# EAGLE schematic UVicorn-kit (EAGLE 7.6.0)
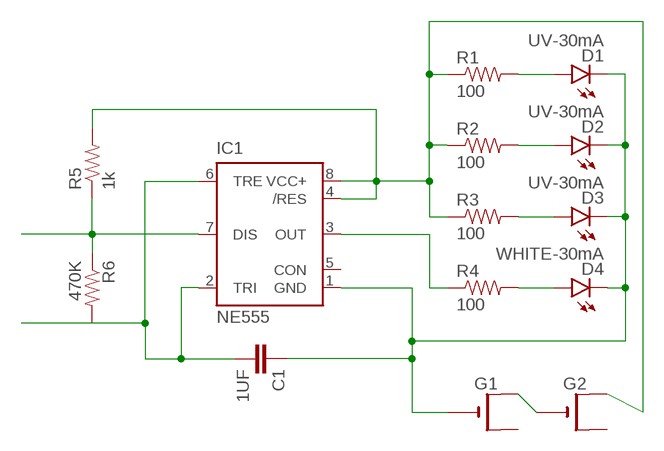
[diagram p0: schematic, sheet 1]

## Parts
C1  1UF  CAP_  [AXIAL-5MM]
D1  UV-30mA  LED  [LED5MM_ANYSIDES]
D2  UV-30mA  LED  [LED5MM_ANYSIDES]
D3  UV-30mA  LED  [LED5MM_ANYSIDES]
D4  WHITE-30mA  LED  [LED5MM_ANYSIDES]
G1  CR2032  [CR2032-EDIT]
G2  CR2032  [CR2032-EDIT]
IC1  NE555  [DIL-08]
R1  100  1KOHM-1/4W-5%(PTH)HORIZ-KIT  [AXIAL-0.3EZ]
R2  100  1KOHM-1/4W-5%(PTH)HORIZ-KIT  [AXIAL-0.3EZ]
R3  100  1KOHM-1/4W-5%(PTH)HORIZ-KIT  [AXIAL-0.3EZ]
R4  100  1KOHM-1/4W-5%(PTH)HORIZ-KIT  [AXIAL-0.3EZ]
R5  1k  1KOHM-1/4W-5%(PTH)HORIZ-KIT  [AXIAL-0.3EZ]
R6  470K  1KOHM-1/4W-5%(PTH)HORIZ-KIT  [AXIAL-0.3EZ]

## Nets
DISCHARGE: IC1.7(DIS) R5.P$1 R6.P$1
GND: C1.P$1 D1.K(C) D2.K(C) D3.K(C) D4.K(C) G1.- IC1.1(GND)
N$2: D4.A R4.P$2
N$3: D3.A R3.P$2
N$4: D2.A R2.P$2
N$5: D1.A R1.P$2
N$9: G1.+1(+) G2.-
OUT: IC1.3(OUT) R4.P$1
THRESHOLD: C1.P$2 IC1.2(TRI) IC1.6(TRE) R6.P$2
VCC: G2.+1(+) IC1.4(/RES) IC1.8(VCC+) R1.P$1 R2.P$1 R3.P$1 R5.P$2
Unconnected: G1.+2(+1) G2.+2(+1) IC1.5(CON)

## Library data of the parts
C1 = SparkFun-Capacitors:CAP: Capacitor Standard 0603 ceramic capacitor, and 0.1" leaded capacitor.
D1-D4 = matt:LED: LEDs Standard schematic elements and footprints for 5mm, 3mm, 1206, and 0603 sized LEDs. 5mm - Spark Fun Electronics SKU : COM-00529 (and others)
G1 G2 = adafruit:CR2032
IC1 = st-microelectronics:NE555: General purpose bipolar Timer; MF: Arrow Electronics; MPN: NE555N; OC_FARNELL: 1467742; OC_NEWARK: 89K1486
R1-R4 R6 = SparkFun-Resistors:1KOHM-1/4W-5%(PTH): RES-08380; PROD_ID: RES-08380; VALUE: 1k
R5 = SparkFun-Resistors:1KOHM-1/4W-5%(PTH): RES-08380; PROD_ID: RES-08380